# EAGLE design mega_pin_out (EAGLE 7.7.0)
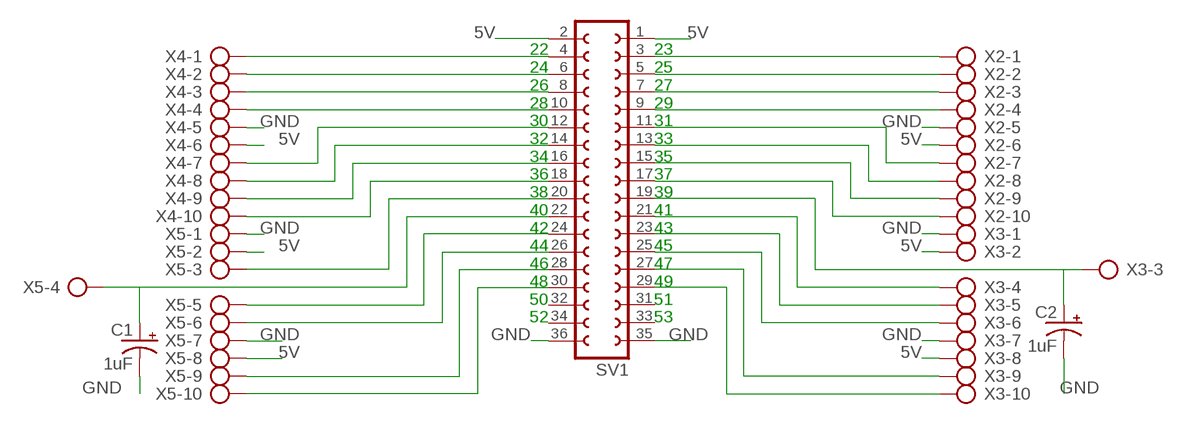
[diagram p0: schematic, sheet 1]

## Parts
C1  1uF  CPOL-USE2-4  [E2-4]
C2  1uF  CPOL-USE2-4  [E2-4]
SV1  FE18-2  [FE18-2]
X2  AK500/10  [AK500/10]
X3  AK500/10  [AK500/10]
X4  AK500/10  [AK500/10]
X5  AK500/10  [AK500/10]

## Nets
5V: SV1.1 SV1.2 X2.6 X3.2 X3.8 X4.6 X5.2 X5.8
GND: C1.- C2.- SV1.35 SV1.36 X2.5 X3.1 X3.7 X4.5 X5.1 X5.7
I31: SV1.11 X2.7
I33: SV1.13 X2.8
I35: SV1.15 X2.9
I47: SV1.27 X3.9
I49: SV1.29 X3.10
N$1: C2.+ SV1.19 X3.3
N$2: SV1.20 X5.3
N$3: SV1.3 X2.1
N$4: SV1.5 X2.2
N$9: SV1.7 X2.3
N$10: SV1.9 X2.4
N$11: SV1.17 X2.10
N$13: SV1.21 X3.4
N$14: SV1.23 X3.5
N$15: SV1.25 X3.6
N$16: SV1.4 X4.1
N$17: SV1.6 X4.2
N$18: SV1.8 X4.3
N$19: SV1.10 X4.4
N$20: SV1.12 X4.7
N$21: SV1.14 X4.8
N$22: SV1.16 X4.9
N$23: SV1.18 X4.10
N$24: C1.+ SV1.22 X5.4
N$26: SV1.24 X5.5
N$27: SV1.26 X5.6
N$28: SV1.28 X5.9
N$29: SV1.30 X5.10
Unconnected: SV1.31 SV1.32 SV1.33 SV1.34

## Notes on the sheet
- 22
  24
  26
  28
  30
  32
  34
  36
  38
  40
  42
  44
  46
  48
  50
  52
- 23
  25
  27
  29
  31
  33
  35
  37
  39
  41
  43
  45
  47
  49
  51
  53

## Library data of the parts
C1 C2 = adafruit:CPOL-US: POLARIZED CAPACITOR, American symbol
SV1 = con-lsta:FE18-2: FEMALE HEADER; OC_FARNELL: unknown; OC_NEWARK: unknown
X2-X5 = con-ptr500:AK500/10: CONNECTOR; OC_FARNELL: unknown; OC_NEWARK: unknown

## Board
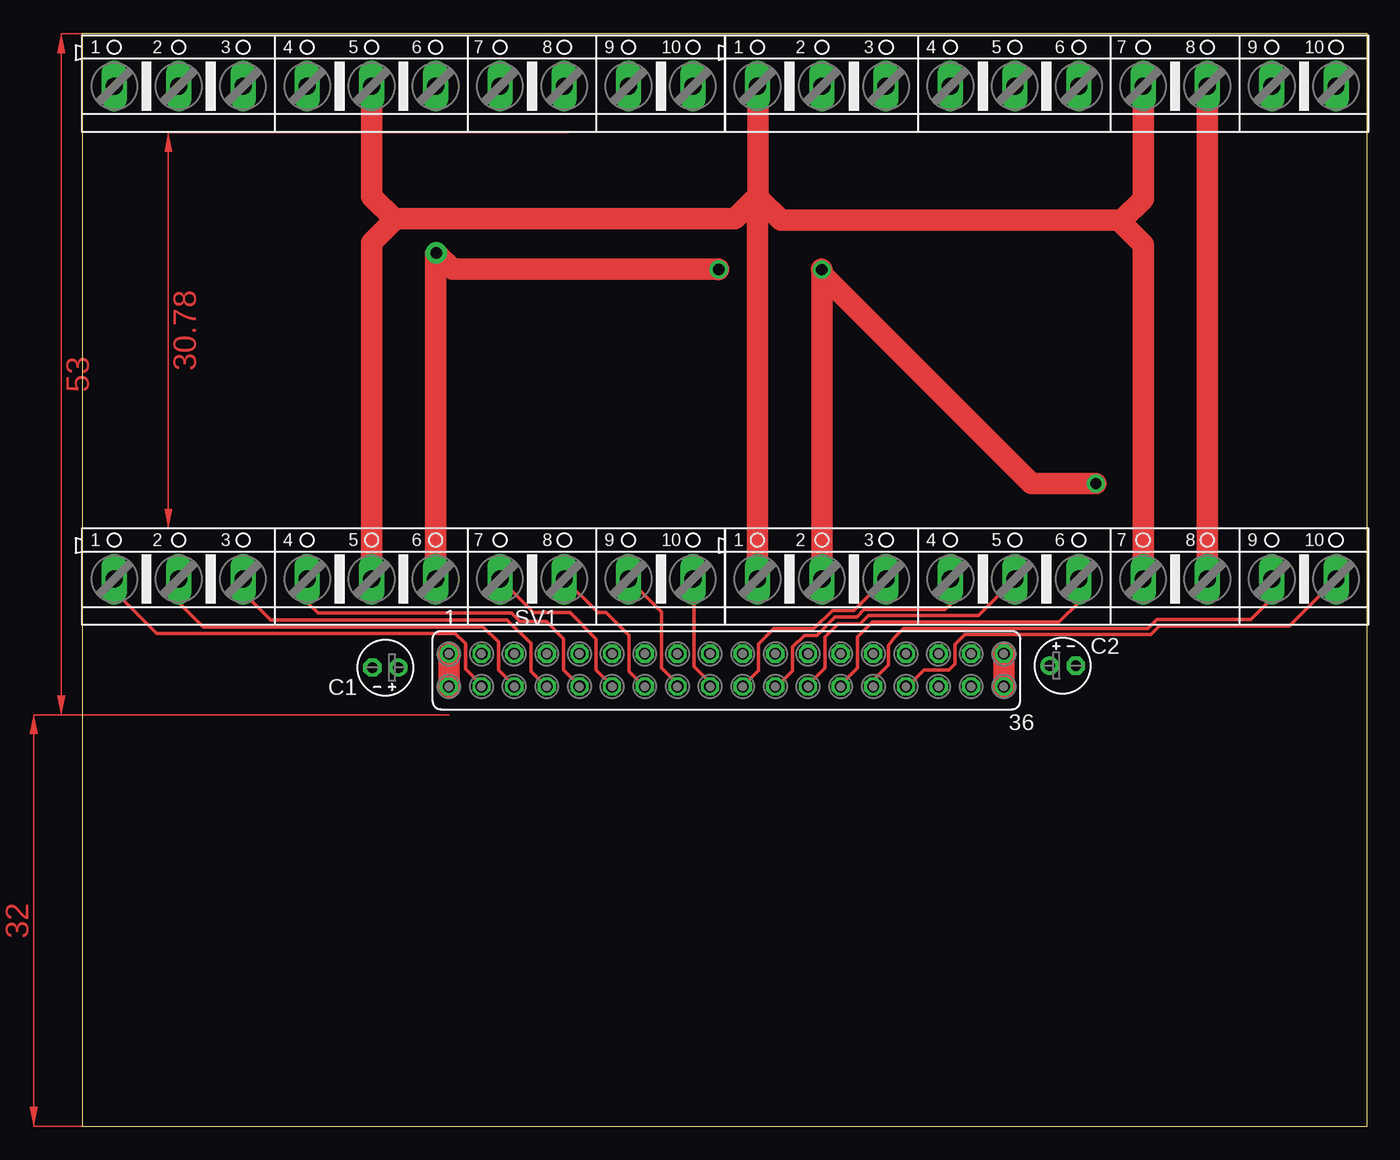
[diagram p1: board, top side]
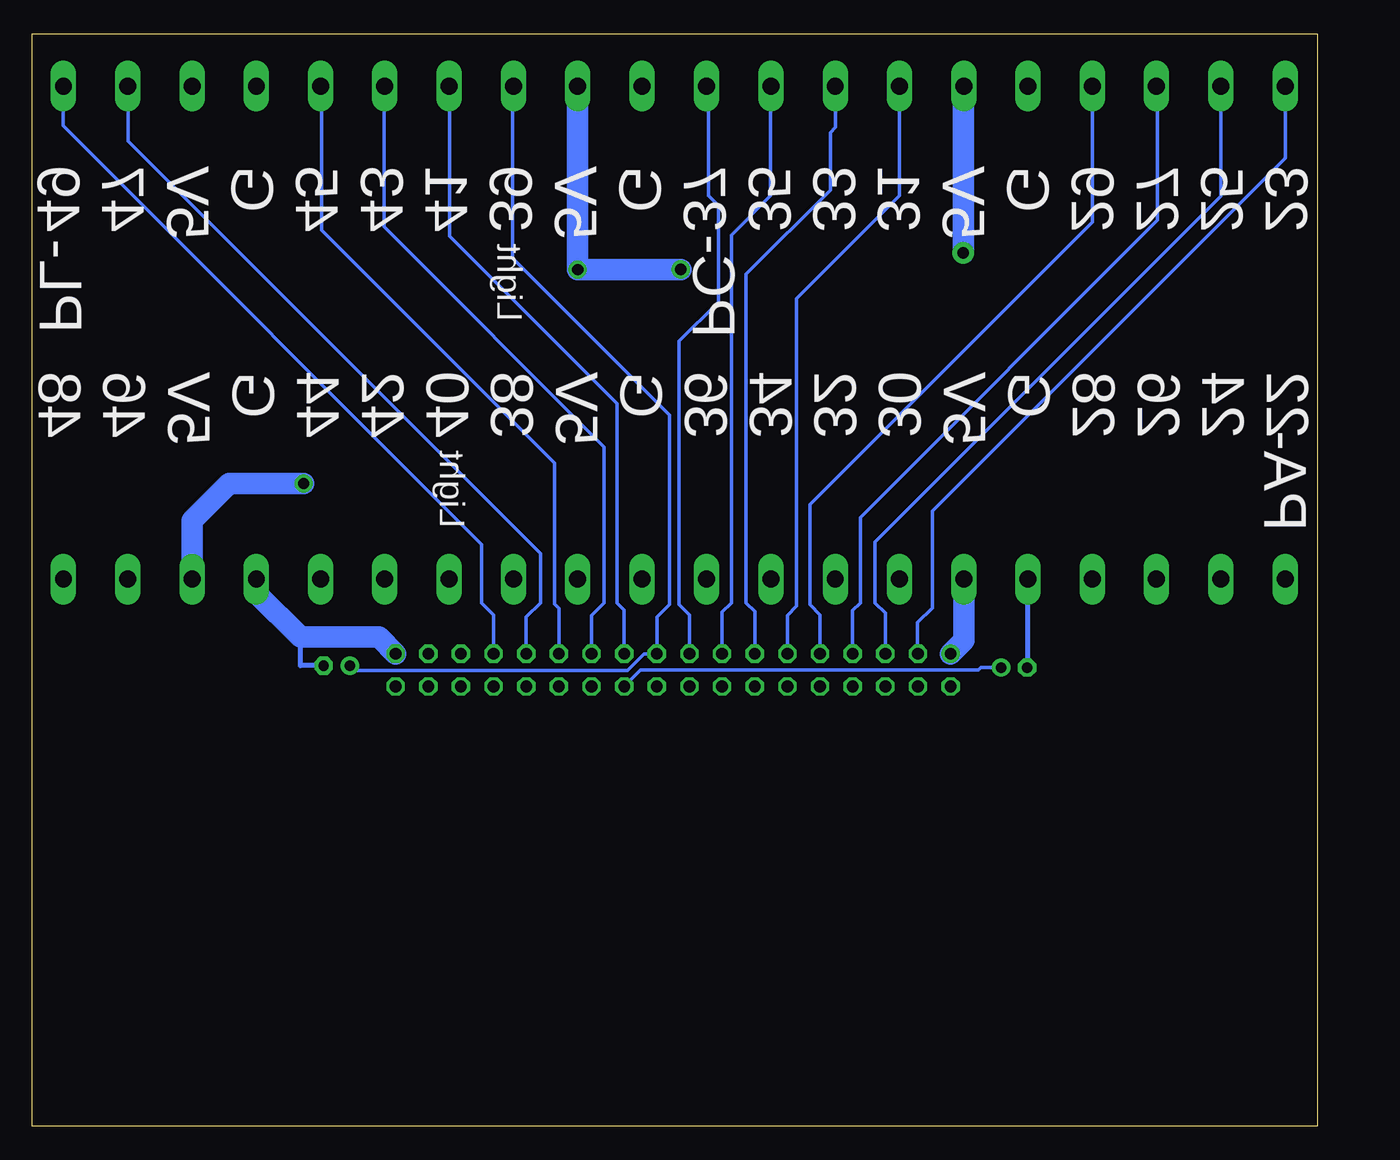
[diagram p2: board, bottom side, seen from below]

Size 100 x 85 mm. Coordinates in mm from the lower left corner, seen from the top.
Outline: 0,0 100,0 100,85 0,85 0,0
Copper layers (1*16): Top 0.035mm / dielectric 1.5mm / Bottom 0.035mm
Design rules "default": minimum track width 10mil, minimum drill 24mil, track to track 8mil, track to pad 8mil, pad to pad 8mil, via to via 8mil, smd to smd 8mil, copper to edge 40mil, drill to drill 8mil, minimum pad ring 10mil, minimum via ring 8mil, stop-mask expansion 4mil, vias tented up to drill 0mil, thermal gap 10mil

### Footprints (pad centres in the part's own frame; a part is rotated, then mirrored left to right if it is on the bottom)
E2-4 = drill 0.813 pad 1.422: + -1.016,0 | drill 0.813 pad 1.422 octagon: - 1.016,0
FE18-2 = drill 0.914: 1 -21.59,1.27 | drill 0.914 octagon: 2 -21.59,-1.27; 3 -19.05,1.27; 4 -19.05,-1.27; 5 -16.51,1.27; 6 -16.51,-1.27; 7 -13.97,1.27; 8 -13.97,-1.27; 9 -11.43,1.27; 10 -11.43,-1.27; 11 -8.89,1.27; 12 -8.89,-1.27; 13 -6.35,1.27; 14 -6.35,-1.27; 15 -3.81,1.27; 16 -3.81,-1.27; 17 -1.27,1.27; 18 -1.27,-1.27; 19 1.27,1.27; 20 1.27,-1.27; 21 3.81,1.27; 22 3.81,-1.27; 23 6.35,1.27; 24 6.35,-1.27; 25 8.89,1.27; 26 8.89,-1.27; 27 11.43,1.27; 28 11.43,-1.27; 29 13.97,1.27; 30 13.97,-1.27; 31 16.51,1.27; 32 16.51,-1.27; 33 19.05,1.27; 34 19.05,-1.27; 35 21.59,1.27; 36 21.59,-1.27
AK500/10 = drill 1.321 long: 1 -22.504,0; 2 -17.501,0; 3 -12.497,0; 4 -7.493,0; 5 -2.489,0; 6 2.489,0; 7 7.493,0; 8 12.497,0; 9 17.501,0; 10 22.504,0

### Placement (x,y rotation side)
C1  23.6,35.69 180 top
C2  76.3,35.84 0 top
SV1  50.13,35.48 0 top
X2  25.02,80.92 0 top
X3  75.06,80.92 0 top
X4  25.02,42.58 0 top
X5  75.06,42.58 0 top

### Tracks (layer width: path | path; a pad name or v marks a point on that pad's centre or on a via)
5V  (via drill 0.89 pad 1.42, 0.89 pad 1.68)
  Top 1.016: 27.51,67.89 v27.56,67.94
  Top 1.676: SV1.2 SV1.1 | X4.6 27.51,67.89 | v57.56,66.65 57.53,66.67 | X3.8 X5.8 | v27.56,67.94 28.83,66.67 49.51,66.67 v49.53,66.66 | X5.2 v57.56,66.65 | v57.56,66.65 57.56,66.31 73.86,50.01 76.7,50.01 v78.88,50.01
  Bottom 1.016: 27.56,80.87 X2.6 | 57.53,80.9 X3.2
  Bottom 1.676: X4.6 27.51,37.78 SV1.1 | v27.56,67.94 27.56,80.87 | X3.2 57.56,66.7 57.53,66.67 v57.56,66.65 57.55,66.66 v49.53,66.66 | X5.8 87.55,47.14 84.68,50.01 v78.88,50.01
GND
  Top 1.016: 24.26,70.61 24.38,70.61 | 52.58,72.39 52.39,72.2 52.55,72.03 | 52.58,80.9 X3.1 52.55,72.29 | 80.64,70.48 80.9,70.48
  Top 1.676: X2.5 22.53,72.34 24.26,70.61 | 52.39,72.2 50.8,70.61 24.38,70.61 22.53,68.76 X4.5 | 52.58,72.39 52.58,80.9 | 52.55,72.29 54.36,70.48 80.64,70.48 82.55,68.58 X5.7 | 80.9,70.48 82.55,72.14 X3.7 | SV1.36 SV1.35 | X5.1 52.55,72.03
  Bottom 0.406: C2.- 79.12,35.84 79.12,38.05 | C1.- 22.53,35.69 X4.5
  Bottom 1.676: X5.7 82.55,41.48 79.12,38.05 73.01,38.05 SV1.35
I31
  Bottom 0.254: SV1.11 41.24,39.74 40.51,40.46 40.51,64.39 32.51,72.39 X2.7
I33
  Bottom 0.254: SV1.13 43.78,40.04 44.45,40.72 44.45,66.29 37.9,72.85 37.9,77.32 37.49,77.72 37.49,80.06 37.52,80.09 X2.8 37.47,80.87
I35
  Bottom 0.254: SV1.15 46.32,39.99 45.59,40.72 45.59,69.34 42.55,72.39 42.55,80.9 X2.9
I47
  Bottom 0.254: SV1.27 61.56,39.61 60.45,40.72 60.45,44.57 92.53,76.65 92.53,80.89 X3.9
I49
  Bottom 0.254: SV1.29 64.1,39.79 65.02,40.72 65.02,45.27 97.59,77.83 97.59,80.9 X3.10
N$1
  Bottom 0.254: C2.+ 74.92,35.48 53.68,35.48 52.4,36.76 SV1.19 51.4,39.61 50.42,40.59 50.42,55.32 62.64,67.54 62.64,80.85 X3.3
N$2
  Top 0.254: X5.3 62.49,42.57 60.06,40.14 58.38,40.14 56.95,38.71 53.84,38.71 52.64,37.51 52.64,35.46 SV1.20
N$3
  Bottom 0.254: SV1.3 31.11,36.79 31.11,39.19 29.97,40.34 29.97,47.88 2.52,75.34 X2.1
N$4
  Bottom 0.254: SV1.5 33.62,39.92 34.42,40.72 34.42,45.47 7.52,72.36 X2.2 7.49,80.9
N$9
  Bottom 0.254: X2.3 12.57,80.87 12.57,80.42 12.45,80.29 12.45,70.48 35.56,47.37 35.56,40.72 36.16,40.12 SV1.7
N$10
  Bottom 0.254: SV1.9 38.7,39.79 39.5,40.59 39.5,48.39 17.53,70.36 X2.4
N$11
  Bottom 0.254: SV1.17 48.86,39.79 49.66,40.59 49.66,61.09 46.61,64.14 46.61,71.63 47.37,72.39 47.37,80.77 X2.10 47.5,80.9
N$13
  Bottom 0.254: 53.94,36.64 SV1.21 53.94,40.17 54.48,40.72 54.48,56.21 67.53,69.26 67.53,80.89 X3.4
N$14
  Bottom 0.254: SV1.23 56.48,39.74 55.5,40.72 55.5,52.86 72.63,69.99 72.63,81.5 72.79,81.65 72.79,81.14 X3.5
N$15
  Bottom 0.254: SV1.25 59.02,40.3 59.35,40.63 59.35,51.59 77.47,69.71 77.47,80.85 X3.6
N$16
  Top 0.254: SV1.4 31.08,34.33 29.84,35.56 29.84,37.54 29.03,38.35 5.82,38.35 2.52,41.66 X4.1
N$17
  Top 0.254: SV1.6 33.62,34.28 32.38,35.51 32.38,37.67 31.19,38.86 9.42,38.86 7.52,40.77 X4.2
N$18
  Top 0.254: SV1.8 36.09,34.21 34.92,35.38 34.92,37.54 33.07,39.4 14.66,39.4 13.03,41.02 12.52,41.02 X4.3
N$19
  Top 0.254: SV1.10 38.7,34.28 37.47,35.51 37.47,37.92 36.12,39.27 34.06,39.27 33.4,39.93 18.36,39.93 17.53,40.77 X4.4
N$20
  Top 0.254: SV1.12 41.24,34.28 40.01,35.51 40.01,37.92 37.97,39.95 35.13,39.95 X4.7
N$21
  Top 0.254: SV1.14 43.71,34.21 42.55,35.38 42.55,38.18 40.77,39.95 40.14,39.95 X4.8
N$22
  Top 0.254: SV1.16 46.32,34.4 45.09,35.64 45.09,40.01 X4.9
N$23
  Top 0.254: SV1.18 48.86,34.53 47.62,35.76 47.62,42.47 X4.10
N$24
  Top 0.254: SV1.22 54.07,34.21 55.28,35.42 55.28,37.28 56.2,38.2 57.16,38.2 58.59,39.63 60.28,39.63 60.84,40.19 67.14,40.19 67.56,40.61 X5.4
  Bottom 0.254: C1.+ 26.16,35.69 26.36,35.48 52.67,35.48 SV1.22
N$26
  Top 0.254: SV1.24 56.48,34.33 57.78,35.64 57.78,38.05 58.8,39.06 60.5,39.06 61.16,39.73 69.72,39.73 X5.5
N$27
  Top 0.254: SV1.26 59.02,34.33 60.33,35.64 60.33,38.05 61.49,39.22 76,39.22 77.55,40.77 X5.6
N$28
  Top 0.254: SV1.28 61.56,34.71 62.74,35.89 62.74,37.41 63.25,38.05 63.91,38.71 82.91,38.71 83.62,39.42 90.93,39.42 92.56,41.05 X5.9
N$29
  Top 0.254: SV1.30 64.24,34.21 65.51,35.48 67.44,35.48 67.92,35.97 67.92,37.49 68.68,38.25 83.13,38.25 83.82,38.94 93.92,38.94 X5.10
(copper drawn outside any net)
  shapes: Top area x3

### Text on the board
bNames: 23 / 25 / 27 / 29 / G / 5V / 31 / 33 / 35 / 37 / G / 5V / 39 / 41 / 43 / 45 / G / 5V / 47 / 49 | PC- | Light | PL- | 22 / 24 / 26 / 28 / G / 5V / 30 / 32 / 34 / 36 / G / 5V / 38 / 40 / 42 / 44 / G / 5V / 46 / 48 | PA- | Light